# EAGLE board OpenBook (EAGLE 9.7.0)
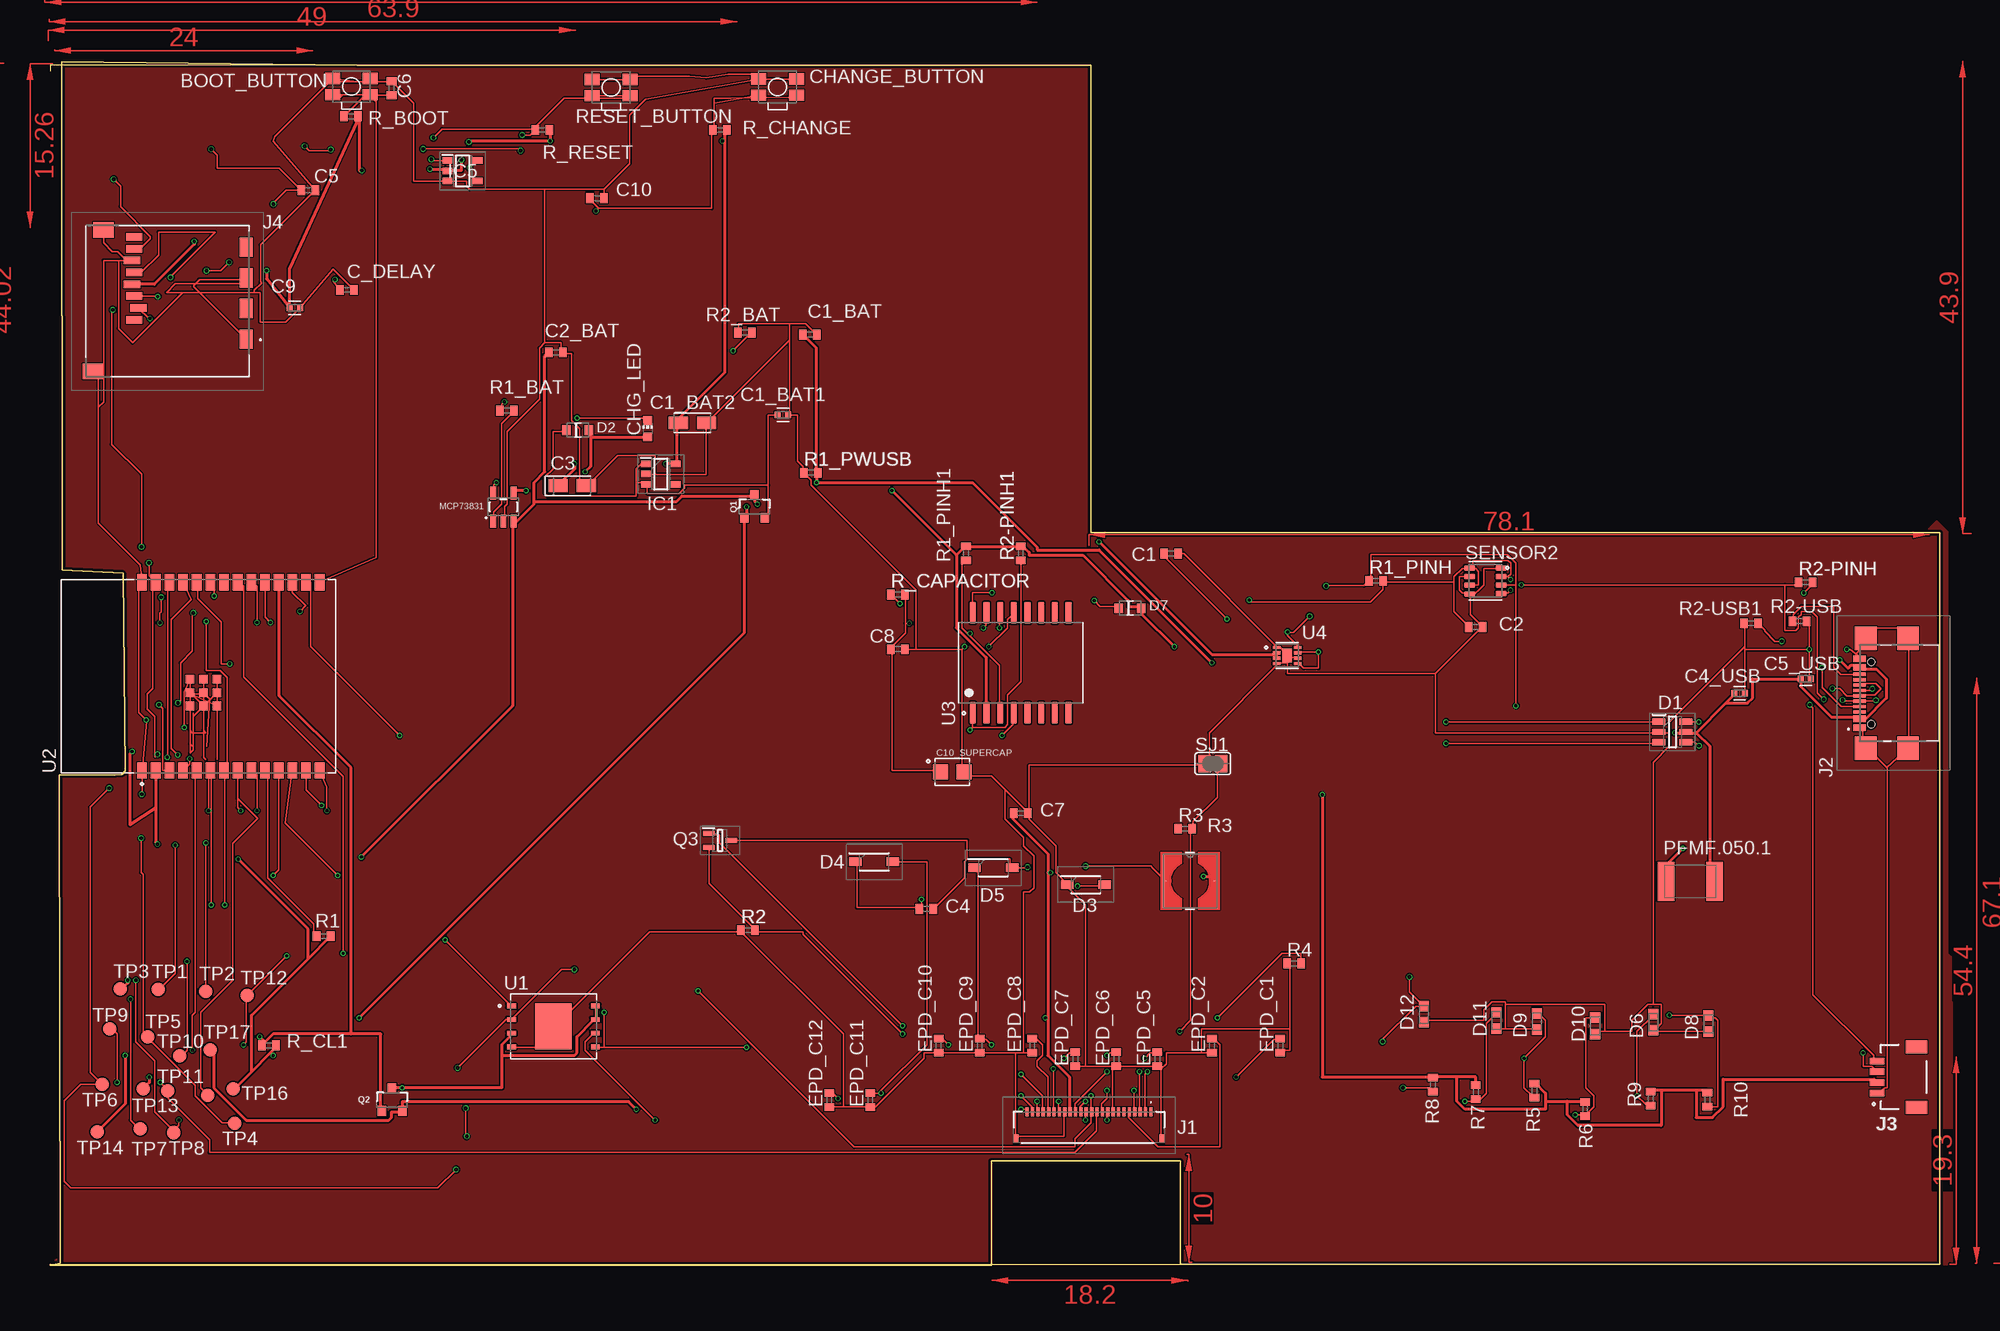
[diagram p1: board, top side]
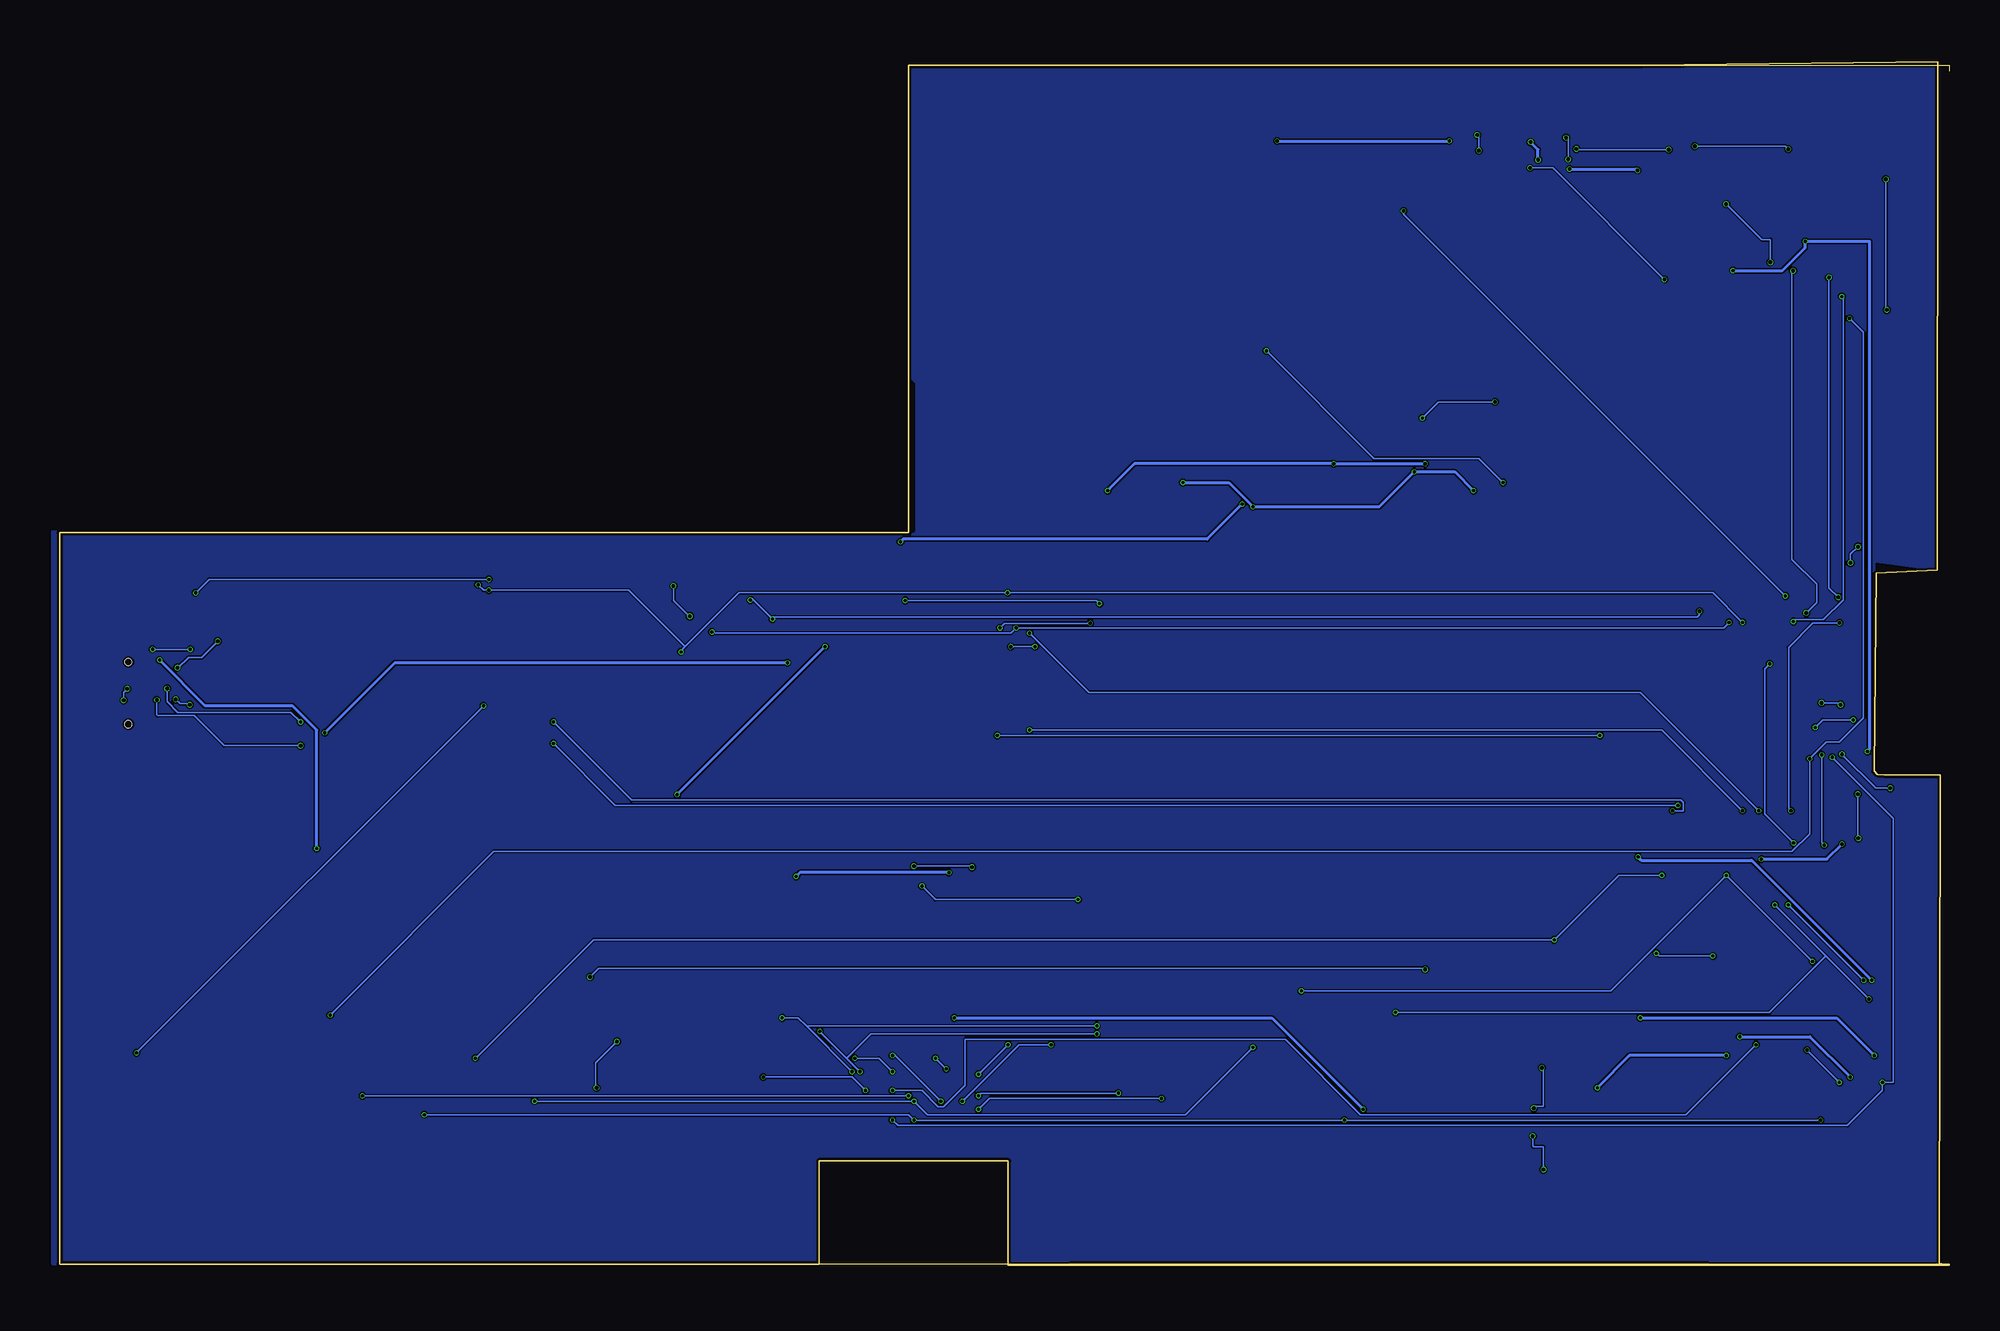
[diagram p2: board, bottom side, seen from below]

Size 175.6 x 111.85 mm. Coordinates in mm from the lower left corner, seen from the top.
Outline: 87.45,0.12 0,0.12 0,0
Outline: 87.45,0.12 105,0.12
Outline: 28.5,111.55 0,111.55 0,111
Outline: 0,0 87.45,0 87.45,0.12
Outline: 87.45,0.12 87.45,9.7 105,9.7 105,0.12
Outline: 105,0.12 175.6,0.12 175.6,68.1 96.7,68.1 96.7,111.55 28.5,111.55
Outline: 0,0 0.9,0.2 0.83,45.59 6.03,45.59 6.66,45.63 6.96,45.93 6.77,64.34 1.12,64.64 1.05,111.85 28.5,111.55
Copper layers (1*16): Top 0.035mm / dielectric 1.6mm / Bottom 0.035mm
Design rules "jlcpcb-2layers.dru": minimum track width 5mil, minimum drill 0.3mm, track to track 5mil, track to pad 5mil, pad to pad 5mil, via to via 5mil, smd to smd 5mil, copper to edge 0.2mm, drill to drill 6mil, minimum pad ring 10mil, minimum via ring 3mil, stop-mask expansion 4mil, vias tented up to drill 0mil, thermal gap 10mil

## Footprints (pad centres in the part's own frame; a part is rotated, then mirrored left to right if it is on the bottom)
MYBUTTON = smd 1.4 x 1.05: 1 1.75,0.75; 2 -1.75,0.75; 3 -1.75,-0.75; 4 1.75,-0.75
ESP32_WROVER_EAGLE-LTSPICE_C0402 = smd 0.7 x 0.9: 1 -0.65,0; 2 0.65,0
CAPC1005X60 = smd 0.56 x 0.629: 1 -0.485,0; 2 0.485,0
CAPM3216X180 = smd 1.796 x 1.189: 1 -1.31,0; 2 1.31,0
CAPMP3216X180N = smd 1.796 x 1.189: 1 -1.31,0; 2 1.31,0
EAGLE-LTSPICE_C0402 = smd 0.7 x 0.9: 1 -0.65,0; 2 0.65,0
CAPCP3225X100N = smd 1.4 x 1.4: 1 -1.1,0; 2 1.1,0
ADAFRUIT_CHIP-LED0603 = smd 0.8 x 0.8: A 0,-0.75; C 0,0.75
SOT95P280X145-6N = smd 1.2 x 0.6: 1 -1.25,0.95; 2 -1.25,0; 3 -1.25,-0.95; 4 1.25,-0.95; 5 1.25,0; 6 1.25,0.95
ESP32_WROVER_AVX---SD0805S020S1R0_AVX_SD0805S020S1R0_0 = smd 0.8 x 0.9: 1 -1.05,0; 2 1.05,0
SOD3716X135N = smd 1.15 x 0.8: 1 -1.75,0; 2 1.75,0
DIOC1608X36N = smd 0.97 x 0.94: 1 -0.75,0; 2 0.75,0
SOT95P280X120-5N = smd 0.9 x 0.6: 1 -1.4,0.95; 2 -1.4,0; 3 -1.4,-0.95; 4 1.4,-0.95; 5 1.4,0.95
SOT95P280X125-5N = smd 0.9 x 0.6: 1 -1.4,0.95; 2 -1.4,0; 3 -1.4,-0.95; 4 1.4,-0.95; 5 1.4,0.95
FH34SRJ24S05SH99 = smd 0.3 x 0.8: 1 5.75,1.45; 2 5.25,1.45; 3 4.75,1.45; 4 4.25,1.45; 5 3.75,1.45; 6 3.25,1.45; 7 2.75,1.45; 8 2.25,1.45; 9 1.75,1.45; 10 1.25,1.45; 11 0.75,1.45; 12 0.25,1.45; 13 -0.25,1.45; 14 -0.75,1.45; 15 -1.25,1.45; 16 -1.75,1.45; 17 -2.25,1.45; 18 -2.75,1.45; 19 -3.25,1.45; 20 -3.75,1.45; 21 -4.25,1.45; 22 -4.75,1.45; 23 -5.25,1.45; 24 -5.75,1.45 | smd 0.4 x 0.8: MP1 6.75,-1.05; MP2 -6.75,-1.05
SAMACSYS_PARTS_USB4110GFA = smd 0.3 x 1.15: A1 -3.35,3.678; A4 -2.55,3.678; A5 -1.25,3.678; A6 -0.25,3.678; A7 0.25,3.678; A8 1.25,3.678; A9 2.55,3.678; A12 3.35,3.678; B1 3.05,3.678; B4 2.25,3.678; B5 1.75,3.678; B6 0.75,3.678; B7 -0.75,3.678; B8 -1.75,3.678; B9 -2.25,3.678; B12 -3.05,3.678 | smd 2.18 x 2: MP1 -5.11,-0.827; MP2 5.11,-0.827; MP3 -5.11,3.103; MP4 5.11,3.103 | hole 0.65: -2.89,2.603; 2.89,2.603
JST04_1MM_RA = smd 0.6 x 1.35: 1 -1.5,0; 2 -0.5,0; 3 0.5,0; 4 1.5,0 | smd 1.2 x 2: NC1 2.8,-3.675; NC2 -2.8,-3.675
112ATAARR03ATTEND = smd 1.8 x 1.2: G1 10.6,10.4; G2 4.9,10.4; S1 7.75,10.4; S2 2.05,10.4 | smd 1.4 x 1.9: G3 13.6,-3.85; G4 0.45,-2.85 | smd 0.7 x 1.5: P1 8.8,0; P2 7.7,0.4; P3 6.6,0; P4 5.5,-0.2; P5 4.4,0; P6 3.3,-0.2; P7 2.2,0; P8 1.1,0
IND_4828-WE-TPC_WRE = smd 0.127 x 0.127: 1 -2.286,0; 2 2.286,0
ESP32_WROVER_SPARKFUN-IC-POWER_SOT23-5 = smd 0.55 x 1.2: 1 -0.95,-1.3; 2 0,-1.3; 3 0.95,-1.3; 4 0.95,1.3; 5 -0.95,1.3
ESP32C6_VARISTOR_CT/CN1812 = smd 1.5 x 3.6: 1 -2.25,0; 2 2.25,0
ESP32_WROVER_SPARKFUN-DISCRETESEMI_SOT23-3 = smd 0.8 x 0.9: 1 -0.95,-1; 2 0.95,-1; 3 0,1.1
SOT65P210X110-3N = smd 1.05 x 0.5: 1 -1.05,0.65; 2 -1.05,-0.65; 3 1.05,0
ESP32_WROVER_EAGLE-LTSPICE_R0402 = smd 0.7 x 0.9: 1 -0.65,0; 2 0.65,0
ESP32_WROVER_BME680_PSON80P300X300X100-8N = smd 1.016 x 0.5: 1 1.458,1.2; 2 1.458,0.4; 3 1.458,-0.4; 4 1.458,-1.2; 5 -1.458,-1.22; 6 -1.458,-0.4; 7 -1.458,0.4; 8 -1.458,1.2
SJ = smd 1.168 x 1.6: 1 -0.762,0; 2 0.762,0
B1,27 = smd 1.27 x 1.27: TP 0,0
SON127P600X800X80-9N = smd 0.94 x 0.44: 1 -3.895,1.905; 2 -3.895,0.635; 3 -3.895,-0.635; 4 -3.895,-1.905; 5 3.895,-1.905; 6 3.895,-0.635; 7 3.895,0.635; 8 3.895,1.905 | smd 3.4 x 4.3: 9 0,0
XCVR_ESP32-C6-WROOM-1-N8 = smd 1.5 x 0.9: 1 -8.75,5.26; 2 -8.75,3.99; 3 -8.75,2.72; 4 -8.75,1.45; 5 -8.75,0.18; 6 -8.75,-1.09; 7 -8.75,-2.36; 8 -8.75,-3.63; 9 -8.75,-4.9; 10 -8.75,-6.17; 11 -8.75,-7.44; 12 -8.75,-8.71; 13 -8.75,-9.98; 14 -8.75,-11.25; 15 8.75,-11.25; 16 8.75,-9.98; 17 8.75,-8.71; 18 8.75,-7.44; 19 8.75,-6.17; 20 8.75,-4.9; 21 8.75,-3.63; 22 8.75,-2.36; 23 8.75,-1.09; 24 8.75,0.18; 25 8.75,1.45; 26 8.75,2.72; 27 8.75,3.99; 28 8.75,5.26 | smd 0.8 x 0.8: 29_1 -2.755,0.79; 29_2 -1.505,0.79; 29_3 -0.255,0.79; 29_4 -2.755,-0.46; 29_5 -1.505,-0.46; 29_6 -0.255,-0.46; 29_7 -2.755,-1.71; 29_8 -1.505,-1.71; 29_9 -0.255,-1.71
SOIC127P1032X265-16N = smd 2.05 x 0.59: 1 -4.655,4.445; 2 -4.655,3.175; 3 -4.655,1.905; 4 -4.655,0.635; 5 -4.655,-0.635; 6 -4.655,-1.905; 7 -4.655,-3.175; 8 -4.655,-4.445; 9 4.655,-4.445; 10 4.655,-3.175; 11 4.655,-1.905; 12 4.655,-0.635; 13 4.655,0.635; 14 4.655,1.905; 15 4.655,3.175; 16 4.655,4.445
SON50P200X200X80-9N = smd 0.76 x 0.27: 1 -0.985,0.75; 2 -0.985,0.25; 3 -0.985,-0.25; 4 -0.985,-0.75; 5 0.985,-0.75; 6 0.985,-0.25; 7 0.985,0.25; 8 0.985,0.75 | smd 0.9 x 1.3: 9 0,0

## Placement (x,y rotation side)
BOOT_BUTTON  BUTTON_CUSYOMV1  [MYBUTTON]  27.98,109.55 0 top
C1  100nF  [ESP32_WROVER_EAGLE-LTSPICE_C0402]  104.14,66.16 0 top
C1_BAT  4.7uF  [ESP32_WROVER_EAGLE-LTSPICE_C0402]  70.59,86.5 0 top
C1_BAT1  4.7uF  [CAPC1005X60]  68.08,79.04 0 top
C1_BAT2  4.7uF  [CAPM3216X180]  59.67,78.31 0 top
C2  100nF  [ESP32_WROVER_EAGLE-LTSPICE_C0402]  132.44,59.32 0 top
C2_BAT  4.7uF  [ESP32_WROVER_EAGLE-LTSPICE_C0402]  46.99,84.84 0 top
C3  100uF TANT  [CAPMP3216X180N]  48.49,72.46 0 top
C4  4.7uF/25V  [EAGLE-LTSPICE_C0402]  81.41,33.13 0 top
C4_USB  100nF  [CAPC1005X60]  156.98,53.18 0 top
C5  1uF  [ESP32_WROVER_EAGLE-LTSPICE_C0402]  23.96,99.93 0 top
C5_USB  4.7uF  [CAPC1005X60]  163.13,54.52 0 top
C6  100nF  [ESP32_WROVER_EAGLE-LTSPICE_C0402]  31.71,109.4 90 top
C7  10uF  [EAGLE-LTSPICE_C0402]  90.17,42.03 0 top
C8  100nF  [EAGLE-LTSPICE_C0402]  78.74,57.27 0 top
C9  100nF  [CAPC1005X60]  22.72,89 0 top
C10  100nF  [ESP32_WROVER_EAGLE-LTSPICE_C0402]  50.8,99.18 0 top
C10_SUPERCAP  CPH3225A  [CAPCP3225X100N]  83.82,45.84 0 top
C_DELAY  100nF  [ESP32_WROVER_EAGLE-LTSPICE_C0402]  27.57,90.65 0 top
CHANGE_BUTTON  BUTTON_CUSYOMV1  [MYBUTTON]  67.58,109.51 0 top
CHG_LED  [ADAFRUIT_CHIP-LED0603]  55.5,77.76 0 top
D1  USBLC6-2SC6Y  [SOT95P280X145-6N]  150.73,49.57 0 top
D2  ESP32_WROVER_AVX---SD0805S020S1R0_AVX_SD0805S020S1R0_0_0AVX_SD0805S020S1R0_0_0  [ESP32_WROVER_AVX---SD0805S020S1R0_AVX_SD0805S020S1R0_0]  49,77.62 0 top
D3  MBR0530  [SOD3716X135N]  96.23,35.39 0 top
D4  MBR0530  [SOD3716X135N]  76.55,37.5 0 top
D5  MBR0530  [SOD3716X135N]  87.63,36.95 0 top
D6  PGB1010603MR  [DIOC1608X36N]  148.95,22.6 90 top
D7  ESP32_WROVER_AVX---SD0805S020S1R0_AVX_SD0805S020S1R0_0_0AVX_SD0805S020S1R0_0_0  [ESP32_WROVER_AVX---SD0805S020S1R0_AVX_SD0805S020S1R0_0]  100.33,61.08 0 top
D8  PGB1010603MR  [DIOC1608X36N]  154.08,22.46 90 top
D9  PGB1010603MR  [DIOC1608X36N]  138.13,22.65 90 top
D10  PGB1010603MR  [DIOC1608X36N]  143.55,22.26 90 top
D11  PGB1010603MR  [DIOC1608X36N]  134.39,22.76 90 top
D12  PGB1010603MR  [DIOC1608X36N]  127.63,23.34 90 top
EPD_C1  1uF/50V  [ESP32_WROVER_EAGLE-LTSPICE_C0402]  114.3,20.44 90 top
EPD_C2  1uF/50V  [ESP32_WROVER_EAGLE-LTSPICE_C0402]  107.95,20.44 90 top
EPD_C5  0.1uF/50V  [ESP32_WROVER_EAGLE-LTSPICE_C0402]  102.87,19.17 90 top
EPD_C6  1uF/50V  [ESP32_WROVER_EAGLE-LTSPICE_C0402]  99.06,19.17 90 top
EPD_C7  1uF/50V  [ESP32_WROVER_EAGLE-LTSPICE_C0402]  95.25,19.17 90 top
EPD_C8  1uF/50V  [ESP32_WROVER_EAGLE-LTSPICE_C0402]  91.24,20.44 90 top
EPD_C9  1uF/50V  [ESP32_WROVER_EAGLE-LTSPICE_C0402]  86.36,20.44 90 top
EPD_C10  1uF/50V  [ESP32_WROVER_EAGLE-LTSPICE_C0402]  82.55,20.44 90 top
EPD_C11  1uF/50V  [ESP32_WROVER_EAGLE-LTSPICE_C0402]  76.2,15.36 90 top
EPD_C12  1uF/50V  [ESP32_WROVER_EAGLE-LTSPICE_C0402]  72.39,15.36 90 top
IC1  XC6220A331MR-G  [SOT95P280X120-5N]  56.73,73.55 0 top
IC5  BD5229G-TR  [SOT95P280X125-5N]  38.3,101.72 0 top
J1  FH34SRJ-24S-0.5SH_99_  [FH34SRJ24S05SH99]  96.52,12.82 0 top
J2  SAMACSYS_PARTS_USB4110-GF-A  [SAMACSYS_PARTS_USB4110GFA]  171.81,53.18 90 top
J3  QWIIC_RIGHT_ANGLE  [JST04_1MM_RA]  169.75,17.5 90 top
J4  112A-TAAR-R03_ATTEND  [112ATAARR03ATTEND]  7.79,96.68 270 top
L1  68uH  [IND_4828-WE-TPC_WRE]  105.92,35.73 0 top
MCP73831  ESP32_WROVER_SPARKFUN-IC-POWER_MCP73831  [ESP32_WROVER_SPARKFUN-IC-POWER_SOT23-5]  42.1,70.49 0 top
PFMF.050.1  ESP32C6_VARISTORCN1812  [ESP32C6_VARISTOR_CT/CN1812]  152.4,35.68 0 top
Q1  20V/4.2A/52mΩ/1.4W  [ESP32_WROVER_SPARKFUN-DISCRETESEMI_SOT23-3]  65.43,70.49 0 top
Q2  20V/4.2A/52mΩ/1.4W  [ESP32_WROVER_SPARKFUN-DISCRETESEMI_SOT23-3]  31.75,15.36 0 top
Q3  SI1308EDL-T1-GE3  [SOT65P210X110-3N]  62.23,39.49 0 top
R1  10k  [ESP32_WROVER_EAGLE-LTSPICE_R0402]  25.4,30.6 0 top
R1_BAT  200  [ESP32_WROVER_EAGLE-LTSPICE_R0402]  42.41,79.44 0 top
R1_PINH  10k  [ESP32_WROVER_EAGLE-LTSPICE_R0402]  123.19,63.62 0 top
R1_PINH1  10k  [ESP32_WROVER_EAGLE-LTSPICE_R0402]  85.09,66.16 90 top
R1_PWUSB  100k  [ESP32_WROVER_EAGLE-LTSPICE_R0402]  70.67,73.67 0 top
R2  2.2  [ESP32_WROVER_EAGLE-LTSPICE_R0402]  64.83,31.15 0 top
R2-PINH  10k  [ESP32_WROVER_EAGLE-LTSPICE_R0402]  163.1,63.49 0 top
R2-PINH1  10k  [ESP32_WROVER_EAGLE-LTSPICE_R0402]  90.17,66.16 90 top
R2-USB  5k1  [ESP32_WROVER_EAGLE-LTSPICE_R0402]  162.54,59.87 0 top
R2-USB1  5k1  [ESP32_WROVER_EAGLE-LTSPICE_R0402]  158.05,59.67 0 top
R2_BAT  2k  [ESP32_WROVER_EAGLE-LTSPICE_R0402]  64.54,86.69 0 top
R3  0.47  [ESP32_WROVER_EAGLE-LTSPICE_R0402]  105.47,40.58 0 top
R4  10k  [ESP32_WROVER_EAGLE-LTSPICE_R0402]  115.57,28.06 0 top
R5  10k  [ESP32_WROVER_EAGLE-LTSPICE_R0402]  137.91,16.25 90 top
R6  10k  [ESP32_WROVER_EAGLE-LTSPICE_R0402]  142.62,14.54 90 top
R7  10k  [ESP32_WROVER_EAGLE-LTSPICE_R0402]  132.46,16.1 90 top
R8  10k  [ESP32_WROVER_EAGLE-LTSPICE_R0402]  128.47,16.78 90 top
R9  10k  [ESP32_WROVER_EAGLE-LTSPICE_R0402]  148.72,15.49 90 top
R10  10k  [ESP32_WROVER_EAGLE-LTSPICE_R0402]  153.98,15.39 90 top
R_BOOT  10k  [ESP32_WROVER_EAGLE-LTSPICE_R0402]  27.94,106.8 0 top
R_CAPACITOR  15  [ESP32_WROVER_EAGLE-LTSPICE_R0402]  78.74,62.35 0 top
R_CHANGE  10k  [ESP32_WROVER_EAGLE-LTSPICE_R0402]  62.23,105.53 0 top
R_CL1  10k  [ESP32_WROVER_EAGLE-LTSPICE_R0402]  20.32,20.44 0 top
R_RESET  10k  [ESP32_WROVER_EAGLE-LTSPICE_R0402]  45.72,105.53 0 top
RESET_BUTTON  BUTTON_CUSYOMV1  [MYBUTTON]  52.11,109.46 0 top
SENSOR2  ESP32_WROVER_BME680_BME680  [ESP32_WROVER_BME680_PSON80P300X300X100-8N]  133.35,63.62 0 top
SJ1  [SJ]  108.03,46.63 0 top
TP1  TPB1,27  [B1,27]  10.04,25.66 0 top
TP2  TPB1,27  [B1,27]  14.45,25.46 0 top
TP3  TPB1,27  [B1,27]  6.48,25.68 0 top
TP4  TPB1,27  [B1,27]  17.15,13.21 0 top
TP5  TPB1,27  [B1,27]  9.03,21.22 0 top
TP6  TPB1,27  [B1,27]  4.83,16.82 0 top
TP7  TPB1,27  [B1,27]  8.33,12.67 0 top
TP8  TPB1,27  [B1,27]  11.45,12.34 0 top
TP9  TPB1,27  [B1,27]  5.53,21.99 0 top
TP10  TPB1,27  [B1,27]  12.04,19.48 0 top
TP11  TPB1,27  [B1,27]  10.9,16.21 0 top
TP12  TPB1,27  [B1,27]  18.29,25.08 0 top
TP13  TPB1,27  [B1,27]  8.65,16.41 0 top
TP14  TPB1,27  [B1,27]  4.36,12.43 0 top
TP15  TPB1,27  [B1,27]  14.62,15.78 0 top
TP16  TPB1,27  [B1,27]  16.99,16.39 0 top
TP17  TPB1,27  [B1,27]  14.87,20.03 0 top
U1  W25Q512JVEIQ  [SON127P600X800X80-9N]  46.75,22.21 0 top
U2  ESP32-C6-WROOM-1-N8  [XCVR_ESP32-C6-WROOM-1-N8]  13.78,54.74 90 top
U3  DS3231SN#  [SOIC127P1032X265-16N]  90.17,56 90 top
U4  MAX17048G+T10  [SON50P200X200X80-9N]  114.94,56.68 0 top

## Tracks (layer width: path | path; a pad name or v marks a point on that pad's centre or on a via)
3V3  (via drill 0.3, 0.35)
  Top 0.3: U1.8 50.7,24 50.7,23 U1.7 50.45,22.75 48.95,21.25 48.95,19.75 48.7,19.5 41.95,19.5 | 41.95,19.5 41.95,20.5 42.7,21.25 42.7,21.5 U1.3 | 41.95,19.5 41.95,16.5 v32.7,16.5 31.95,16.5 Q2.3 | 18.7,18 17.45,16.75 17.2,16.75 17.2,16.5 TP16.TP | 18.7,18 20.45,19.75 | 20.45,19.75 20.95,20.25 R_CL1.2 | 23.95,28.5 18.7,23.25 18.7,18 | 23.95,28.5 R1.2 | v17.45,37.75 23.95,31.25 23.95,28.5 | v9.95,39.15 9.79,39.31 U2.2 9.79,42.52 7.39,40.94 7.39,47.55 v7.59,47.75 | 20.45,19.75 v20.7,19.5 | 36.9,101.75 38.2,101.75 v38.2,102.75 | 36.9,101.75 36.7,101.75 36.7,101.89 v35.28,101.89 | R_RESET.2 46.45,105.5 v46.45,104.5 39,104.5 v38.9,104.4 | 28.7,106.75 28.7,101.75 v28.95,101.75 | 28.7,106.75 22.23,92.67 C9.1 20.09,91.69 v20.09,92.45 | 28.7,106.75 R_BOOT.2 | v13.37,95.17 13.37,94.89 9.67,91.18 J4.P4 | 36.9,101.75 IC5.2 | 130.7,17.5 132.45,17.5 R7.2 | 130.7,17.5 128.7,17.5 R8.2 128.45,17.5 118.2,17.5 v118.2,43.75 | 138.95,15.25 140.95,15.25 | 140.95,15.25 142.45,15.25 R6.2 | 138.95,15.25 138.95,16 137.95,17 R5.2 | 130.7,17.5 130.7,15.25 131.45,14.5 138.95,14.5 138.95,15.25 | 152.95,16.25 153.95,16.25 R10.2 | 152.95,16.25 149.7,16.25 | 149.7,16.25 148.95,16.25 R9.2 | 152.95,16.25 152.95,13.75 154.45,13.75 155.45,14.75 155.45,17.3 169.45,17.3 J3.2 | 140.95,15.25 140.95,14 141.95,13 149.7,13 149.7,16.25 | 84.2,66 84.2,59.25 86.95,56.5 86.95,51.5 U3.2 | 84.2,66 84.95,66.75 R1_PINH1.2 85.2,66.75 89.95,66.75 R2-PINH1.2 90.2,67 90.95,66.25 90.95,66 95.95,66 100.2,61.75 100.2,61.25 101.2,61.25 D7.2 101.45,61 101.45,60.5 v104.45,57.5 | 62.7,104.5 62.7,83 58.45,78.75 58.45,78.5 C1_BAT2.1 58.2,78.25 58.2,74.5 IC1.5 v57.2,74.5
  Top 0.3: 62.7,104.5 62.7,105.5 R_CHANGE.2 | v48.7,74.5 48.7,74 47.2,72.5 C3.1 | v78.2,72 84.2,66 | 62.7,104.5 v62.45,104.5
  Bottom 0.3: v9.95,39.15 11.35,37.75 v17.45,37.75 | v32.7,16.5 29.7,19.5 v20.7,19.5 | v20.09,92.45 15.49,92.45 13.37,94.58 v13.37,95.17 7.4,95.17 7.4,47.95 v7.59,47.75 | v35.28,101.89 29.09,101.89 v28.95,101.75 | v48.7,74.5 v57.2,74.5 75.7,74.5 v78.2,72 | v104.45,57.5 v118.2,43.75 | v62.45,104.5 v46.45,104.5 | v38.2,102.75 38.2,103.7 v38.9,104.4
32KHZ  (via drill 0.3)
  Top 0.127: 85.7,50 88.7,50 88.95,50.25 88.95,53 90.2,54.25 90.2,65.5 R2-PINH1.1 | 85.7,50 85.7,51.25 U3.1 | 85.7,50 v85.45,49.75 | v19.2,42.25 19.2,45.57 U2.9
  Bottom 0.127: v19.2,42.25 26.7,49.75 v85.45,49.75
DN  (via drill 0.35)
  Top 0.127: D1.4 152.78,48.62 153.1,48.3 v153.2,48.3 | v166.55,52.54 166.66,52.43 J2.B7 169.64,52.43 v169.64,52.52 | v169.31,53.58 169.16,53.43 J2.A7
  Bottom 0.127: v153.2,48.3 160.3,48.3 163.1,51.1 166.5,51.1 166.55,51.15 v166.55,52.54 | v169.64,52.52 169.64,53.25 v169.31,53.58
DP  (via drill 0.3, 0.35)
  Top 0.127: 167.74,52.93 J2.A6 166.94,52.93 166.27,53.6 v165.6,53.6 | v153.2,50.5 152.2,50.5 D1.6
  Top 0.152: J2.B6 168.25,54.05 169.64,54.05 170.1,53.59 170.1,53.56 169.55,53.02 168.22,53.02 J2.A6
  Bottom 0.127: v153.2,50.5 154.1,51.4 164.6,51.4
  Bottom 0.152: 164.6,51.4 165.6,52.4 v165.6,53.6
EPD_3V3  (via drill 0.3)
  Top 0.3: TP17.TP 14.95,20 15.2,19.75 15.2,16.5 18.2,13.5 31.45,13.5 31.7,13.75 31.7,14.25 32.7,14.25 Q2.2 32.7,15.2 53.75,15.2 v54.45,14.5 | 92.7,36.5 92.7,38.25 89.45,41.5 89.45,42 C7.1 | 92.7,36.5 92.7,23 | 92.7,23 92.7,19.5 94.7,17.5 94.7,14.5 J1.16 | v107.15,36.15 107.8,36.15 108.2,35.75 L1.2 | 92.7,36.5 v92.95,36.5 | 92.7,23 v92.45,23
  Bottom 0.3: v107.15,36.15 106.8,36.5 v92.95,36.5 | v54.45,14.5 62.95,23 v92.45,23
EPD_3V3_C  (via drill 0.3)
  Top 0.3: 19.95,20.75 20.7,21.5 27.95,21.5 | 19.95,20.75 19.7,20.5 R_CL1.1 19.95,20.75 | 27.95,21.5 30.7,21.5 30.7,14.5 Q2.1 | v9.2,17.5 9.2,17 8.7,16.5 TP13.TP | 19.95,20.75 v19.45,21.25 | 27.95,21.5 27.95,46.26 21.28,52.93 21.28,63.47 U2.18
  Bottom 0.3: v9.2,17.5 12.95,21.25 v19.45,21.25
EPD_BUSY  (via drill 0.3)
  Top 0.127: v98.2,13.5 98.2,14.25 J1.9 | v6.2,17 6.2,21.5 5.7,22 TP9.TP | v10.86,47.22 10.92,47.27 10.92,63.44 U2.26
  Bottom 0.127: v98.2,13.5 97.7,13 9.46,13 6.2,16.26 v6.2,17 5.2,17 5.2,41.55 v10.86,47.22
EPD_CS  (via drill 0.3)
  Top 0.127: v12.7,28.25 12.7,20 12.2,19.5 TP10.TP | v20.7,36.25 21.2,36.75 21.2,45.98 U2.11 | v96.7,15.75 96.7,14.5 J1.12 96.7,14.25 96.7,13.25 95.2,11.75 95.2,11 74.7,11 v60.2,25.5 | R9.1 148.7,15 148.2,15 v147.45,15.75 147.45,21.75 148.95,23.25 D6.2
  Bottom 0.127: v12.7,28.25 v20.7,36.25 31.45,25.5 v60.2,25.5 | v147.45,15.75 v96.7,15.75
EPD_DC  (via drill 0.3)
  Top 0.127: J1.11 97.2,14.25 97.2,12.5 95.2,10.5 14.8,10.5 14.8,11.65 10.95,15.5 10.95,16 TP11.TP 10.7,16.25 10.7,16.5 v10.2,17 | v13.2,20 13.2,23.25 13.45,23.5 13.45,45.9 U2.5
  Bottom 0.127: v10.2,17 v13.2,20
EPD_RST  (via drill 0.3)
  Top 0.127: v98.2,16.25 98.2,15.5 97.7,15 97.7,14.5 J1.10 | v17.95,20.5 18.2,20.75 18.2,25 TP12.TP 18.45,25.25 v21.95,28.75 | v27.2,29 27.2,45.45 17.95,54.7 17.95,63.13 U2.21
  Bottom 0.127: v98.2,16.25 95.45,16.25 93.95,14.75 93.45,14.75 91.45,16.75 91.45,21 61.7,21 54.7,14 24.45,14 v17.95,20.5 | v27.2,29 26.95,28.75 v21.95,28.75
FLASH_CS  (via drill 0.3)
  Top 0.127: R5.1 137.7,15.75 136.95,16.5 v136.95,19.25 138.95,21.25 138.95,22.75 138.2,23.5 D9.2 | v36.7,30.25 42.7,24.25 U1.1 | v26.7,36.25 21.84,41.11 U2.12
  Bottom 0.127: v26.7,36.25 30.7,36.25 v36.7,30.25 125.95,30.25 v136.95,19.25
GDR  (via drill 0.3)
  Top 0.127: v101.95,18 101.7,17.75 101.7,14.5 J1.2 | v108.45,23 114.45,29 116.2,29 116.2,28.25 R4.2 | v79.2,22.25 62.2,39.25 62.2,40 61.2,40 Q3.1
  Bottom 0.127: 106.2,22.25 106.95,23 v108.45,23 | 106.2,22.25 v101.95,18 | 106.2,22.25 v79.2,22.25
GND  (via drill 0.3, 0.35)
  Top 0.127: 36.9,100.75 38.7,100.75 38.7,100.25 38.95,100 45.95,100 | 51.45,100 45.95,100 | C10.2 51.45,100 | 53.31,110.56 RESET_BUTTON.1 54.17,110.52 59.43,110.52 60.94,110.36 62.97,110.72 65.36,110.72 CHANGE_BUTTON.2 | CHANGE_BUTTON.2 55.33,108.37 53.85,106.89 53.85,102.4 51.45,100 | 45.95,85.75 45.45,85.25 45.45,80.5 42.45,77.5 42.45,70.75 42.2,70.5 42.2,69.25 MCP73831.2 | 45.95,85.75 47.45,85.75 47.45,85 C2_BAT.2 47.7,84.75 48.45,84.75 48.45,78.5 49.2,77.75 49.2,73 49.7,72.5 C3.2 49.95,72.5 52.7,75.25 56.2,75.25 56.2,73.5 | 56.2,73.5 60.95,73.5 60.95,78.25 C1_BAT2.2 61.2,78.5 68.7,86 | 56.2,73.5 55.45,73.5 IC1.2 | 68.7,87.5 63.95,87.5 63.95,86.75 R2_BAT.1 | 68.7,87.5 70.2,87.5 71.2,86.5 C1_BAT.2 | 68.7,87.5 68.7,86 | 68.7,86 68.7,79.25 C1_BAT1.2 68.7,79 69.45,79 69.45,74.75 69.95,74.25 69.95,73.75 R1_PWUSB.1 70.2,73.5 70.7,73 70.7,72.5 80.43,62.77 80.43,57.25 | 45.95,85.75 45.95,100 | TP4.TP 16.95,13.25 15.95,13.25 13.45,15.75 13.45,16.75 9.2,21 TP5.TP 8.61,21.38 8.61,36.34 8.44,36.51 v8.44,39.69 | 12.99,49.71 13.2,49.5 14.45,49.5 14.24,49.71 U2.29_6 | 12.99,53.33 U2.29_3 12.45,53.31 v12.45,50 | 12.99,53.33 12.99,53.24 | 12.99,53.24 U2.29_2 | 12.99,53.11 12.99,49.71 | U2.29_1 12.99,47.61 13.26,47.88 13.26,51 | U2.29_7 13.36,52.95 12.99,53.33 | 14.45,47 14.24,47.21 U2.29_4 13.13,53.09 13.13,53.11 | 13.21,48.25 12.99,48.47 12.99,49.71 | U2.29_2 12.99,53.17 | 12.99,53.17 12.99,53.11 | 14.51,48.22 14.83,52.65 U2.29_5 14.11,53.11 13.34,53.11 | U2.29_8 13.26,51 | U2.29_7 15.49,47.03 | U2.29_9 U2.29_8 | U2.29_8 U2.29_7 | U2.1 8.98,50.58 v8.9,50.69 8.22,51.38 8.22,63.19 U2.28 8.36,65.09 4.45,69 4.45,79.75
  Top 0.127: 8.61,45.93 U2.1 | 4.45,79.75 4.95,80.25 4.95,93.38 J4.P6 6.33,93.38 6.33,87.07 7.65,85.75 12.3,90.41 | 18.95,90.41 18.95,90.62 19.64,91.31 19.54,91.41 19.54,94.85 C5.2 20.7,104.49 20.83,104.9 BOOT_BUTTON.2 28.59,110 30.51,110 C6.2 33.74,108.02 33.74,100.75 36.9,100.75 | C_DELAY.2 26.28,92.59 C9.2 21.88,87.67 19.48,87.67 19.48,90.41 18.95,90.41 | 18.95,90.41 12.3,90.41 | 12.3,90.41 10.81,90.41 10.8,90.42 11.61,91.23 17.63,91.23 J4.G2 18.04,91.63 13.89,91.63 13.82,91.63 | 4.45,79.75 4.45,83.47 J4.G3 | 36.9,100.75 IC5.3 | 135.2,22 134.45,22 D11.1 | 135.2,22 137.95,22 D9.1 | 135.2,22 135.2,24.25 | 135.2,24.25 135.2,24.5 133.95,24.5 133.2,23.75 133.2,22.75 127.7,22.75 D12.1 | 144.45,21.75 146.95,21.75 146.95,22.75 148.45,24.25 148.95,24.25 | 144.45,21.75 143.7,21.75 D10.1 | 148.95,24.25 149.7,24.25 149.7,22.5 148.95,21.75 | 148.95,21.75 153.95,21.75 D8.1 | 148.95,21.75 D6.1 | 135.2,24.25 144.45,24.25 144.45,21.75 | v163.45,57.25 163.45,59.5 163.2,59.75 R2-USB.2 | v163.45,57.25 163.45,54.75 C5_USB.2 | 157.45,57.5 157.45,59.5 R2-USB1.1 | 157.45,57.5 157.45,57.25 | 157.45,57.25 157.45,53.25 C4_USB.2 | 150.45,49.5 149.7,49.5 D1.2 149.45,49.5 128.7,49.5 128.7,55 | 150.45,49.5 150.45,50.5 157.45,57.5 | 157.45,57.25 v163.45,57.25 | 168.7,59.25 171.77,59.25 J2.MP2 172.7,58.23 | 169.07,59.25 J2.MP4 168.45,58.15 168.45,57.5 167.77,56.82 J2.A12 167.25,57.25 v166.95,57.25 | J2.B12 168.42,50.25 168.42,49.1 168.45,49.07 168.45,49 | 168.2,49.89 J2.A1 | 168.45,48.22 168.58,48.14 | 170.66,46.28 168.75,48.2 J2.MP3 | 170.66,46.28 170.7,46.25 170.7,16.5 170.5,16.5 J3.1 | 170.66,46.28 J2.MP1 172.7,48.13 172.7,58.08 172.7,59
  Top 0.127: 148.95,24.25 148.95,46.75 150.45,48.25 150.45,49.5 | J1.17 94.2,14.25 94.2,12 89.95,12 J1.MP2 89.7,12 89.7,19.75 | 89.7,19.75 86.45,19.75 EPD_C9.1 86.2,19.75 82.7,19.75 EPD_C10.1 82.45,19.75 81.2,19.75 81.2,19.25 76.7,14.75 76.2,14.75 | 89.7,19.75 90.45,19.75 | 90.45,19.75 91.2,19.75 EPD_C8.1 | U1.4 42.95,20.25 46.7,20.25 46.7,22 U1.9 46.95,22.25 55.7,31 63.95,31 R2.1 64.2,31 73.7,21.5 73.7,14.75 | 76.2,14.75 73.7,14.75 | 73.7,14.75 72.45,14.75 EPD_C12.1 | 76.2,14.75 EPD_C11.1 | 131.95,62 131.95,62.25 SENSOR2.5 131.7,62.5 131.2,62.5 130.95,62.75 130.95,64 131.7,64 SENSOR2.7 | 131.95,62 131.95,60.5 132.95,59.5 C2.2 132.95,59.25 128.7,55 | 131.95,62 133.2,63.25 133.2,64.75 134.7,64.75 SENSOR2.1 | 114.95,56 114.2,56 U4.4 113.95,56 113.95,55.75 107.7,49.5 107.7,47 107.45,46.75 SJ1.1 107.2,46.5 90.95,46.5 90.95,42.25 C7.2 | 114.95,56.5 114.95,56 | 114.95,56.5 115.7,56.5 U4.6 | 114.95,56.5 U4.9 114.7,56.75 114.7,57 114.2,57.5 U4.1 113.95,57.53 105.33,66.16 C1.2 | 128.7,55 114.95,55 114.95,56 | 115.2,22 115.2,27.75 114.95,28 R4.1 | 115.2,22 115.2,20 114.45,20 EPD_C1.1 | 98.95,18.5 98.7,18.25 98.7,14.5 J1.8 | 98.95,18.5 96.2,18.5 | 96.2,18.5 95.45,18.5 EPD_C7.1 | 98.95,18.5 EPD_C6.1 99.2,18.5 102.7,18.5 EPD_C5.1 | 103.2,18.25 103.2,12 J1.MP1 | 103.2,18.25 102.95,18.5 EPD_C5.1 | 106.95,19.75 103.7,19.75 103.7,18.75 103.2,18.25 | 106.95,19.75 107.95,19.75 EPD_C2.1 | 103.2,18.25 EPD_C5.1 | 115.2,22 106.95,22 106.95,19.75 | 84.7,57.25 80.43,57.25 | 80.43,57.25 79.45,57.25 C8.2 | 84.7,57.25 84.7,46 C10_SUPERCAP.2 84.95,45.75 84.95,45.5 87.45,45.5 88.7,44.25 | 88.7,44.25 90.7,42.25 C7.2
  Top 0.127: C7.2 90.95,42 90.95,41.5 93.45,39 93.45,36.5 94.45,35.5 D3.1 94.7,35.25 94.7,35 96.2,33.5 96.2,18.5 | v87.2,57.5 88.95,59.25 88.95,60 89.45,60.5 U3.13 | 84.7,57.25 v84.95,57.5 | 90.45,39 90.45,39.75 88.7,41.5 88.7,44.25 | 90.45,19.75 90.45,34.7 | BOOT_BUTTON.1 29.43,110 26.9,110 | 13.26,51.34 13.26,51 | U2.29_2 12.99,53.24 | 13.34,53.11 13.13,53.11 | 13.05,53.11 12.99,53.11 | U2.29_2 13.11,53.11 | 13.11,53.11 13.13,53.11 | 13.11,53.11 13.05,53.11 | 13.05,53.11 12.99,53.17 | U2.29_2 13.21,53.23 13.34,53.11 | U2.1 8.52,43.81 v8.49,43.78 | J4.G1 13.32,90.95 | CHANGE_BUTTON.1 CHANGE_BUTTON.2
  Top 0.152: 90.45,39 91.4,38.05 91.4,35.1 91,34.7 90.45,34.7 | C6.2 31.65,109.99 26.9,110 | 50.76,109.96 RESET_BUTTON.2 RESET_BUTTON.1 53.37,109.72 | 13.89,91.63 13.32,91.06 13.32,90.95 | J4.P6 7.08,93.38 6.24,94.22 5.75,94.22 4.94,95.04 J4.G4 | J2.MP4 168.7,59.25 | J2.MP3 168.64,48.14 168.58,48.14 | J2.MP2 172.7,58.23 172.7,58.08 | J2.B12 J2.A1 | J2.A12 J2.B1 | J2.MP3 168.7,47.67 168.57,47.53 | J2.MP3 168.45,48.33 168.45,49.07
  Bottom 0.127: v12.45,50 11.76,50.69 v8.9,50.69 | v166.95,57.25 v163.45,57.25 | v84.95,57.5 v87.2,57.5 | v8.49,43.78 8.49,39.79 8.41,39.72 v8.44,39.69
GPIO8
  Top 0.127: R1.1 24.7,30.75 24.45,31 24.45,31.75 20.2,36 20.2,45.36 U2.10
I2C_PW  (via drill 0.3)
  Top 0.127: v162.95,62.5 163.7,63.25 R2-PINH.2 | 135.45,64 v135.7,63.75 | 135.45,64 134.95,64 SENSOR2.2 | 130.45,63.5 130.45,64 131.2,64.75 131.7,64.75 SENSOR2.8 | 130.45,63.5 130.45,60.75 131.7,59.5 C2.1 | 132.2,64.75 131.95,64.75 SENSOR2.8 | 132.2,64.75 132.45,64.75 132.7,64.5 132.7,63.25 131.95,63.25 SENSOR2.6 | v109.35,60.06 v109.36,60.07 103.49,65.93 C1.1 | v111.42,61.83 111.57,61.67 122.68,61.67 123.84,62.83 R1_PINH.2 123.95,63.5 130.45,63.5 | v23.2,60.78 23.72,61.31 22.49,62.54 U2.17 | 135.45,64 135.7,64.25 135.7,65.25 135.45,65.5 132.2,65.5 132.2,64.75 | 132.2,64.75 SENSOR2.8
  Bottom 0.127: v162.95,62.5 161.7,63.75 v135.7,63.75 | v111.42,61.83 111.27,61.98 v109.35,60.06 109.14,60.27 23.39,60.27 23.2,60.46 v23.2,60.78
INT_RTC  (via drill 0.3)
  Top 0.127: 85.45,58.5 88.2,55.75 88.2,51.5 U3.3 | 85.45,58.5 84.7,59.25 84.7,65.25 84.95,65.5 R1_PINH1.1 | TP15.TP 14.45,16 13.95,16.5 13.95,23.5 16.95,26.5 16.95,39.2 19.27,41.52 17.41,43.37 U2.8 17.41,42.54 v17.7,42.25 | v85.45,58.75 85.45,58.5
  Bottom 0.127: v85.45,58.75 79.95,53.25 28.7,53.25 v17.7,42.25
IO/BOOT
  Top 0.127: 29.68,108.83 BOOT_BUTTON.4 29.75,108.75 | 30.3,108.51 30.3,108.15 30.3,65.78 U2.15 | BOOT_BUTTON.3
  Top 0.152: 29.58,108.8 29.29,108.8 | 29.29,108.8 R_BOOT.1 | 29.58,108.8 BOOT_BUTTON.4 29.73,108.72 30.3,108.15 | 29.29,108.8 27.18,108.8 | 26.88,108.5 27.18,108.8 | 27.18,108.8 BOOT_BUTTON.3 | C6.1 29.64,108.75 29.58,108.8
IO/CHANGE  (via drill 0.3)
  Top 0.127: CHANGE_BUTTON.4 69.13,108.56 63.26,108.46 61.7,108.46 61.7,108.02 | 50.95,98.25 50.2,99 C10.1 | 50.95,98.25 61.45,98.25 61.45,105.5 R_CHANGE.1 61.7,105.75 61.7,108.02 | 50.95,98.25 v50.7,98 | v15.22,62.2 15.22,63 U2.23 | CHANGE_BUTTON.3 61.7,108.02
  Bottom 0.127: v50.7,98 50.7,97.68 v15.22,62.2
MISO  (via drill 0.35)
  Top 0.127: v8.47,66.78 8.47,73.53 5.7,76.3 5.7,88.7 v5.8,88.8 | v9.16,65.29 9.16,64.11 U2.27 9.53,63.23 9.53,53.63 9,53.1 9,51.7 9.7,51 9.7,47.3 9.73,47.27 v9.96,47.49 | v5.47,44.35 3.7,42.58 3.7,17.95 TP6.TP 2.82,16.82 1.3,15.3 1.3,7.8 1.9,7.2 36,7.2 v37.7,8.9 | v37.85,18.35 42.34,22.84 U1.2 47.51,27.5 v48.7,27.5 | v126.3,26.8 126.3,25.42 D12.2 126.89,24.09 123.7,20.9 v123.8,20.8 | v125.7,16.5 128.1,16.5 R8.1 | J4.P7 8.35,94.48 9.29,95.43 9.29,95.62 6.52,98.39 6.52,100.3 v5.88,100.94 | v38.6,14.6 38.6,12.1 v38.7,12
  Bottom 0.127: v8.47,66.78 9.16,66.08 v9.16,65.29 | v9.96,47.49 6.82,44.35 v5.47,44.35 | v37.7,8.9 37.7,11 38.6,11 38.7,11.1 v38.7,12 | v37.85,18.35 37.8,18.4 37.7,18.3 37.7,14.8 38.5,14.8 38.6,14.7 v38.6,14.6 | v48.7,27.5 48.8,27.6 125.5,27.6 v126.3,26.8 | v123.8,20.8 125.8,18.8 125.8,16.5 v125.7,16.5 | v5.88,100.94 5.88,88.88 v5.8,88.8
MOSI  (via drill 0.3)
  Top 0.127: v7.45,24.75 7.45,13.5 8.2,12.75 TP7.TP | v16.2,33.5 16.2,45.92 U2.7 16.45,46.25 16.45,54.64 15.79,55.3 14.47,55.3 v14.47,59.84 | v9.98,90.04 9.93,90.08 J4.P3 | v96.2,15.25 95.7,14.75 95.7,14.5 J1.14 | v131.45,15.25 132.45,15.25 R7.1 132.7,15.25 133.45,16 133.45,22.5 133.95,23 133.95,23.25 134.2,23.5 D11.2 | v64.7,20.25 51.45,20.25 | 51.45,20.25 50.7,20.25 U1.5 | 51.45,20.25 v51.45,23.5
  Bottom 0.127: v16.2,33.5 11.45,28.75 | 11.45,28.75 v7.45,24.75 | v14.47,59.84 14.3,60.01 11.68,60.01 9.86,61.83 9.86,89.92 v9.98,90.04 | v131.45,15.25 v96.2,15.25 94.95,14 70.95,14 v64.7,20.25 | 11.45,28.75 16.7,23.5 v51.45,23.5
N$1
  Top 0.127: 66.7,72.5 66.7,69.75 66.45,69.5 Q1.2 | 66.7,72.5 66.7,79 67.45,79 C1_BAT1.1 | 54.45,72.75 55.2,72.75 IC1.3 55.45,72.5 55.45,71.75 58.45,71.75 58.95,72.25 58.95,72.5 66.7,72.5 | 54.45,72.75 54.45,74 54.95,74.5 IC1.1 | 54.45,72.75 54.45,71.5 46.2,71.5 45.95,71.75 45.95,73.25 46.7,74 46.7,77.5 47.95,77.5 D2.1
N$3  (via drill 0.35)
  Top 0.127: J2.A5 166.44,51.93 | R2-USB1.2 159.3,59.07 159.3,58.97
  Top 0.152: 159.3,58.97 160.27,58 v160.9,58 | v164.65,55.55 164.65,53.72 166.44,51.93
  Bottom 0.152: v160.9,58 162.4,56.5 163.6,56.5 164.6,55.5 v164.65,55.55
N$5  (via drill 0.3)
  Top 0.127: D4.1 74.95,37.5 74.95,33.25 80.7,33.25 C4.1 80.95,33.25 v80.95,34 | v95.45,35.25 97.95,35.25 D3.2
  Bottom 0.127: v95.45,35.25 94.2,34 v80.95,34
N$6  (via drill 0.3)
  Top 0.127: v63.45,85 64.95,86.5 R2_BAT.2 | v41.45,72.75 41.2,72.5 41.2,72 MCP73831.5
  Bottom 0.127: v63.45,85 53.45,75 43.7,75 v41.45,72.75
N$7
  Top 0.127: R1_BAT.2 42.95,79.25 41.95,78.25 41.95,70.75 41.2,70 41.2,69.25 MCP73831.1
N$8  (via drill 0.3)
  Top 0.127: v48.95,78.75 55.45,78.75 CHG_LED.C | v42.2,80.25 41.95,80 41.95,79.5 R1_BAT.1
  Bottom 0.127: v48.95,78.75 47.45,80.25 v42.2,80.25
N$9  (via drill 0.3)
  Top 0.127: v100.7,16.25 100.7,14.5 J1.4 | v110.2,17.5 113.7,21 114.2,21 EPD_C1.2
  Bottom 0.127: v100.7,16.25 101.95,17.5 v110.2,17.5
N$10
  Top 0.127: J1.5 100.2,14.25 100.2,13.75 102.95,11 108.7,11 108.7,20.5 107.95,21.25 EPD_C2.2
N$11  (via drill 0.3)
  Top 0.127: v98.2,18 95.2,15 95.2,14.5 J1.15 | v101.7,19.25 102.2,19.75 102.7,19.75 EPD_C5.2
  Bottom 0.127: v98.2,18 99.45,19.25 v101.7,19.25
N$12  (via drill 0.3)
  Top 0.127: v93.7,15.25 93.7,14.5 J1.18 | v98.2,19.5 98.45,19.75 98.95,19.75 EPD_C6.2
  Bottom 0.127: v93.7,15.25 97.95,19.5 v98.2,19.5
N$13  (via drill 0.3)
  Top 0.127: v93.2,18.25 93.2,14.5 J1.19 | v94.2,19.25 94.7,19.75 95.2,19.75 EPD_C7.2
  Bottom 0.127: v94.2,19.25 v93.2,18.25
N$14
  Top 0.127: J1.20 92.7,14.5 92.7,17.5 91.7,18.5 91.7,19 92.2,19.5 92.2,20.5 91.45,21.25 EPD_C8.2
N$15  (via drill 0.3)
  Top 0.127: v38.95,102 39.59,102.64 IC5.5 | C_DELAY.1 26.3,91.48 v26.45,91.63
  Bottom 0.127: v26.45,91.63 36.83,102 v38.95,102
N$16  (via drill 0.3)
  Top 0.127: v91.7,15.25 91.7,14.5 J1.22 | v83.45,20.5 82.7,21.25 EPD_C10.2
  Bottom 0.127: v91.7,15.25 86.45,20.5 v83.45,20.5
N$17  (via drill 0.3)
  Top 0.127: v78.95,61.5 78.2,62.25 R_CAPACITOR.1 | v97.01,61.79 97.55,61.25 99.2,61.25 D7.1
  Bottom 0.127: v97.01,61.79 79.24,61.79 v78.95,61.5
N$18  (via drill 0.3)
  Top 0.127: v90.2,14.5 90.7,14.5 J1.24 | v73.2,15.5 72.45,16.25 EPD_C12.2
  Bottom 0.127: v90.2,14.5 89.2,15.5 v73.2,15.5
N$20
  Top 0.127: J2.B5 166.36,54.93 165.72,55.58 165.72,61.25 162.7,61.25 161.95,60.5 161.95,60 R2-USB.1
PREVGH  (via drill 0.3)
  Top 0.127: v90.2,17.75 92.2,15.75 92.2,14.5 J1.21 | v87.45,20.5 86.95,21 86.45,21 EPD_C9.2 86.2,21.25 86.2,36.5 85.95,36.75 D5.1
  Bottom 0.127: v87.45,20.5 v90.2,17.75
PREVGL  (via drill 0.3)
  Top 0.127: v90.2,15.75 91.2,14.75 91.2,14.5 J1.23 | EPD_C11.2 v77.2,16 77.2,16.25 81.45,20.5 81.45,37.5 D4.2
  Bottom 0.127: v90.2,15.75 89.95,16 v77.2,16
RESE  (via drill 0.3)
  Top 0.127: Q3.2 61.2,38.75 61.2,35.5 65.45,31.25 R2.2 65.7,31 69.95,31 69.95,30.75 v79.2,21.5 | v101.2,18 101.2,14.5 J1.3 | v104.95,21.75 105.95,22.75 105.95,40.5 R3.2 106.2,40.75 106.2,41.25 108.45,43.5 108.45,46.25 108.7,46.5 SJ1.2
  Bottom 0.127: v104.95,21.75 102.45,19.25 | 102.45,19.25 v101.2,18 | v79.2,21.5 100.2,21.5 102.45,19.25
RESET  (via drill 0.35)
  Top 0.127: 45.07,105.6 45.07,105.8 47.73,108.47 53.61,108.47 RESET_BUTTON.4 RESET_BUTTON.3 | 45.07,105.6 R_RESET.1 44.59,105.05 v43.85,105.05 | v43.7,103.6 43.54,103.76 v34.65,103.76 | C5.1 22.35,99.93 | v16.61,93.22 15.82,92.43 v14.5,92.43 | v13.29,60.64 13.2,60.55 13.2,57.09 12.1,55.99 12.1,52.52 v11.86,52.27 | v10.1,52.1 10.43,51.77 10.43,45.99 U2.3 | C5.1 21.25,101.99 15.49,101.99 15.49,103.2 v14.95,103.74 | v23.63,104.01 24.04,103.6 25.97,103.6 v26.06,103.69 | IC5.1 35.53,102.67 v35.4,102.8 | v35.6,104.8 36.4,105.6 45.07,105.6 | C5.1 21.92,99.93 20.68,98.68 v20.72,98.64
  Bottom 0.127: v14.5,92.43 14.6,92.34 14.6,65.6 12.3,63.3 12.3,61.62 v13.29,60.64 | v11.86,52.27 10.1,52.27 v10.1,52.1 | v14.95,103.74 15.22,104.01 v23.63,104.01 | v35.4,102.8 35.4,104.7 35.5,104.8 v35.6,104.8 | v43.7,103.6 43.7,105 43.8,105.1 v43.85,105.05 | v34.65,103.76 34.58,103.69 v26.06,103.69 | v20.72,98.64 17.42,95.34 16.61,95.34 v16.61,93.22
RTC_RST  (via drill 0.3)
  Top 0.127: v32.45,49.25 24.2,57.5 24.2,63.49 U2.16 | v88.45,49.25 89.45,50.25 89.45,51.25 U3.4
  Bottom 0.127: v88.45,49.25 v32.45,49.25
RX  (via drill 0.3)
  Top 0.127: v14.45,39.25 TP2.TP | v16.68,55.91 15.87,55.91 15.87,59.79 13.69,61.97 13.69,63.4 U2.24
  Bottom 0.127: v14.45,39.25 17.15,41.95 17.15,55.43 v16.68,55.91
SCK  (via drill 0.3, 0.35)
  Top 0.127: 11.45,12.5 9.7,14.25 9.7,19 7.95,20.75 v7.95,26.5 | v14.95,33.5 14.95,45.88 U2.6 14.7,45.8 v14.7,42.25 | v10.18,59.71 10.18,60.6 10.3,60.73 v10.3,62.09 v10.3,62.1 | J4.P5 8.44,92.28 10.05,93.89 10.05,96.03 15.3,96.03 11.17,91.89 v11.17,91.81 | v96.2,13.5 96.2,14.25 J1.13 | v141.7,14 142.45,14 R6.1 142.7,14 143.45,14.75 143.45,15.75 142.7,16.5 142.7,23 143.45,23 D10.2 | v56.2,13.5 49.7,20 49.7,20.75 50.45,21.5 U1.6 | 11.45,12.5 11.95,13 v11.95,13.5 | 11.45,12.5 TP8.TP
  Bottom 0.127: v14.95,33.5 v7.95,26.5 | v10.18,59.71 12.65,59.71 14.92,57.44 14.92,42.47 v14.7,42.25 | v141.7,14 96.7,14 v96.2,13.5 v56.2,13.5 v11.95,13.5 | v11.17,91.81 11.17,62.96 v10.3,62.1
SCL  (via drill 0.3, 0.35)
  Top 0.127: v87.5,62.52 85.7,62.52 85.7,60.75 U3.16 | v19.2,59.75 19.2,63.07 U2.20 | U4.5 115.95,56 116.45,55.5 117.85,55.5 v117.85,57.01 117.84,57 115.95,57 U4.7 | v136.7,63.25 161.2,63.25 | 161.2,63.25 162.45,63.25 R2-PINH.1 | v135.7,62.75 135.45,62.5 134.95,62.5 SENSOR2.4 | 161.2,63.25 161.2,59 162.2,59 162.45,59.25 162.45,60.25 162.7,60.5 162.7,60.75 163.7,60.75 164.2,60.25 164.2,53.2 v164.8,52.6 | J3.4 169.45,19.3 169.45,19.5 163.8,25.15 163.8,51.8 v163.5,52.1
  Bottom 0.127: v19.2,59.75 21.97,62.52 v87.5,62.52 112.43,62.52 117.45,57.5 | v136.7,63.25 136.2,62.75 v135.7,62.75 122.7,62.75 117.45,57.5 | v117.85,57.01 117.89,57.06 117.45,57.5 | v164.8,52.6 164.4,52.2 163.5,52.2 v163.5,52.1
SDA  (via drill 0.3, 0.35)
  Top 0.127: U2.19 19.95,60.25 v20.45,59.75 | v86.7,59.25 86.95,59.5 86.95,60.5 U3.15 | 122.7,64 122.45,64 | 122.7,64 122.7,63.75 R1_PINH.1 | U4.8 115.95,57.5 115.98,57.53 114.97,58.53 114.97,58.82 | 136.2,63.25 134.95,63.25 SENSOR2.3 | 136.2,63.25 136.2,65.25 135.39,66.06 122.7,66.06 122.7,64 | 122.7,64 R1_PINH.1 | v168.45,19.75 168.45,18.5 169.25,18.5 J3.3 | 136.2,63.25 v136.2,52 | 114.97,58.82 v114.97,58.86 | R1_PINH.1 122.08,63.16 118.55,63.16 v118.55,63.14 | v117.02,60.32 115.53,58.82 114.97,58.82
  Bottom 0.127: v20.45,59.75 20.95,59.25 v86.7,59.25 87.19,58.76 114.87,58.76 v114.97,58.86 | v136.2,52 v168.45,19.75 | v118.55,63.14 118.55,61.78 117.06,60.28 v117.02,60.32
SIGNAL1
  pour Top: 17.82,0.28 17.84,0.26 18.23,-0.12 87.07,-0.12 87.42,0.23 87.42,9.67 87.34,9.76 87.32,9.78 87.32,9.82 87.34,9.84 87.36,9.86 87.38,9.88 104.82,9.88 104.84,9.86 105.36,9.34 105.38,9.32 105.38,0.58 105.36,0.56 104.78,-0.02 116.07,-0.02 116.46,0.36 116.48,0.38 157.12,0.38 157.14,0.36 157.43,0.08 176.57,0.08 176.72,0.23 176.72,28.57 176.34,28.96 176.32,28.98 176.32,68.17 175.3,69.19 174.14,68.04 174.12,68.02 109.48,68.02 109.46,68.04 109.37,68.12 96.93,68.12 96.54,67.74 96.52,67.72 96.48,67.72 96.46,67.74 96.44,67.76 96.42,67.78 96.42,111.52 96.44,111.54 96.62,111.72 73.93,111.72 73.84,111.64 73.82,111.62 1.14,111.62 1.14,64.48 6.62,64.48 6.64,64.47 6.66,64.45 6.68,64.42 6.68,45.72 6.66,45.69 6.64,45.67 6.62,45.66 0.86,45.66 0.86,0.87 0.85,0.84 0.28,0.28
SIGNAL2
  pour Bottom: 22.36,0.46 22.38,0.48 81.72,0.48 81.74,0.46 82.3,-0.09 82.66,0.26 82.68,0.28 87.37,0.28 87.42,0.33 87.42,9.82 87.44,9.84 87.46,9.86 87.48,9.88 104.92,9.88 104.94,9.86 104.96,9.84 104.98,9.82 104.98,0.28 104.97,0.28 175.22,0.28 175.24,0.26 175.43,0.08 176.27,0.08 176.32,0.13 176.32,68.22 176.33,68.22 148.83,68.22 148.64,68.04 148.62,68.02 96.18,68.02 96.16,68.04 96.04,68.16 96.02,68.18 96.02,82.02 96.04,82.04 96.82,82.83 96.82,111.67 96.77,111.72 87.43,111.72 87.34,111.64 87.32,111.62 1.36,111.62 1.36,64.6 6.81,65.37 6.81,65.37 6.82,65.37 6.83,65.37 6.84,65.37 6.85,65.37 6.85,65.37 6.86,65.37 6.87,65.36 6.87,65.36 6.88,65.35 6.89,65.35 6.89,65.34 6.89,65.34 6.9,65.33 6.9,65.32 6.9,65.32 6.91,65.31 6.91,65.3 6.91,65.29 6.91,65.29 6.91,46.25 6.89,46.22 6.32,45.65 6.29,45.64 0.67,45.64 0.67,0.18 22.07,0.18
SRC  (via drill 0.35)
  Top 0.127: 85.2,37.75 84.95,37.5 84.95,36 82.2,33.25 C4.2 | 85.2,37.75 89.2,37.75 89.2,37 D5.2 90.1,36.95 | 85.2,37.75 85.2,39.5 63.45,39.5 Q3.3 | 102.41,36.95 L1.1
  Top 0.152: 90.1,36.95 90.75,36.95 v90.8,37 | v96.2,37.1 102.26,37.1 102.41,36.95
  Bottom 0.152: v96.2,37.1 90.9,37.1 v90.8,37
SS_SD  (via drill 0.3)
  Top 0.127: R10.1 154.2,14.75 154.95,14.75 154.95,22.75 154.7,23 154.2,23 D8.2 153.95,23.25 v150.45,23.25 | v9.25,88 9.17,88 J4.P2 | v12.95,47.09 12.95,46.62 U2.4
  Bottom 0.127: v9.25,88 7.96,86.72 7.96,50.88 10.22,48.63 11.42,48.63 v12.95,47.09 12.95,40.1 14.6,38.45 135.25,38.45 v150.45,23.25
TX  (via drill 0.3)
  Top 0.127: v11.6,39.05 11.6,27.15 10.2,25.75 TP1.TP | v11.84,47.45 11.23,48.06 11.23,60.03 13.08,61.88 U2.25
  Bottom 0.127: v11.6,39.05 11.84,39.29 v11.84,47.45
USB_D+  (via drill 0.3)
  Top 0.127: v129.7,50.5 149.45,50.5 D1.1 | v25.7,42.25 25.7,44.44 U2.14
  Bottom 0.127: v129.7,50.5 122.45,43.25 24.95,43.25 24.7,43 24.7,42.25 v25.7,42.25
USB_D-  (via drill 0.3)
  Top 0.127: v129.7,48.5 149.45,48.5 D1.3 | U2.13 23.76,44.19 v25.2,42.75
  Bottom 0.127: v129.7,48.5 123.95,42.75 v25.2,42.75
VBAT  (via drill 0.3)
  Top 0.3: 113.95,56.75 113.95,57 U4.2 | 113.95,56.75 113.95,56.5 U4.3 | 44.95,71 44.95,70.75 43.2,69 MCP73831.3 42.95,69 42.95,52 v28.9,37.95 | 44.95,71 44.95,72.75 45.95,73.75 45.95,84.5 46.2,84.75 C2_BAT.1 | 44.95,71 58.2,71 58.7,71.5 65.2,71.5 Q1.3 65.45,71.5 65.45,71 v65.7,70.75 | 113.95,56.75 107.95,56.75 v97.45,67.25 | v7.2,26.5 7.2,26.25 6.7,25.75 TP3.TP
  Bottom 0.3: v97.45,67.25 97.2,67.5 68.95,67.5 v65.7,70.75 | v7.2,26.5 18.35,37.65 28.6,37.65 v28.9,37.95
VBUS  (via drill 0.3)
  Top 0.3: 152.95,49.5 155.7,52.25 | 155.7,52.25 156.45,53 C4_USB.1 | 152.95,49.5 152.2,49.5 D1.5 151.95,49.5 v150.95,49.5 | 155.7,52.25 157.7,52.25 158.2,52.75 158.2,54.5 162.45,54.5 C5_USB.1 162.64,53.82 165.54,50.93 J2.B9 | 152.95,49.5 154.2,48.25 154.2,36 154.45,35.75 PFMF.050.1.2 | 50.2,77 55.45,77 CHG_LED.A | 50.2,77 50.2,77.5 D2.2 | v44.2,72 43.2,72 MCP73831.4 | v49.7,73.75 50.2,74.25 50.2,77 | v64.7,70.5 64.7,69.5 Q1.1 64.45,69.25 64.45,58.75 v28.7,23 | C1_BAT.1 71.2,85.25 71.2,73.75 R1_PWUSB.2 71.2,73.5 v71.2,72.75 85.7,72.75 91.7,66.75 91.7,66.5 97.45,66.5 v107.95,56 | v6.95,19.5 6.95,15 4.45,12.5 TP14.TP
  Bottom 0.3: v44.2,72 45.95,73.75 v49.7,73.75 52.95,70.5 v64.7,70.5 66.95,72.75 v71.2,72.75 | v6.95,19.5 10.45,23 v28.7,23 | v150.95,49.5 144.45,56 v107.95,56
VRTC  (via drill 0.3)
  Top 0.127: 79.45,59.67 79.45,62.25 R_CAPACITOR.2 | 79.45,59.67 79.45,58.75 78.2,57.5 C8.1 78.2,57.25 78.2,46 82.7,46 C10_SUPERCAP.1 | v88.2,59.25 88.2,60.5 U3.14 | 79.45,59.67 v79.82,59.67
  Bottom 0.127: v88.2,59.25 87.78,59.67 v79.82,59.67
VUSB  (via drill 0.3)
  Top 0.3: 168.2,55.43 J2.B4 168.17,55.39 | v151.7,38.75 150.2,37.25 150.2,35.75 PFMF.050.1.1 | v166.3,56.25 167.06,55.49 167.3,55.73 J2.A9 168.17,55.69 168.17,55.39 | 168.17,55.39 169.71,55.39 170.63,54.47 170.63,52.72 168.54,50.63 J2.A4
  Bottom 0.3: v166.3,56.25 162.05,52 153.95,52 151.7,49.75 v151.7,38.75
(copper drawn outside any net)
  shapes: Top area x13